# EAGLE design BD (EAGLE 6.4)
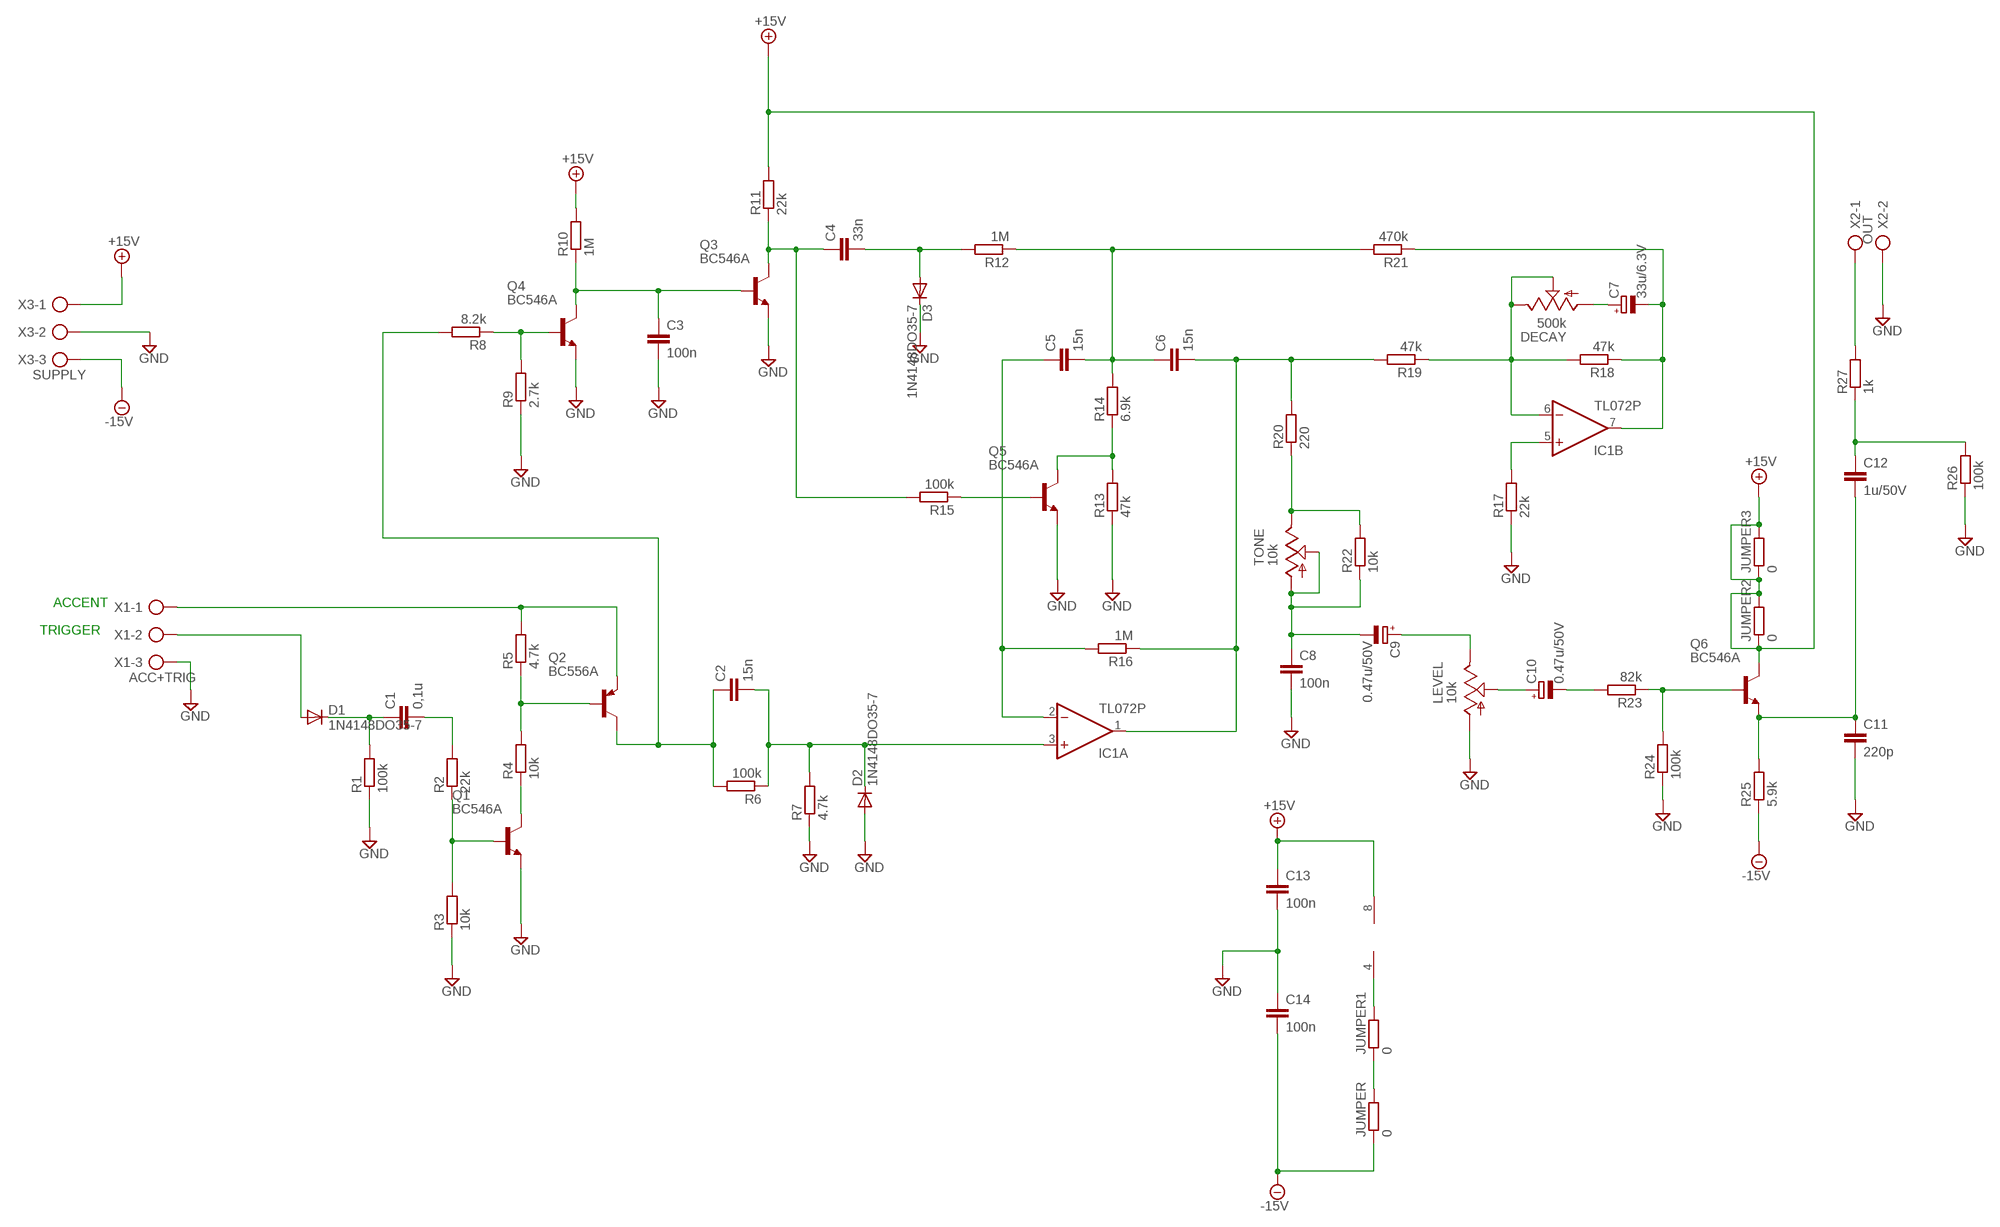
[diagram p0: schematic, sheet 1]

## Parts
C1  0,1u  C-EU075-042X103  [C075-042X103]
C2  15n  C-EU075-042X103  [C075-042X103]
C3  100n  C-EU075-042X103  [C075-042X103]
C4  33n  C-EU075-042X103  [C075-042X103]
C5  15n  C-EU075-042X103  [C075-042X103]
C6  15n  C-EU075-042X103  [C075-042X103]
C7  33u/6.3V  CPOL-EUE2-5  [E2-5]
C8  100n  C-EU075-042X103  [C075-042X103]
C9  0.47u/50V  CPOL-EUE2-5  [E2-5]
C10  0.47u/50V  CPOL-EUE2-5  [E2-5]
C11  220p  C-EU075-042X103  [C075-042X103]
C12  1u/50V  C-EU075-042X103  [C075-042X103]
C13  100n  C-EU075-042X103  [C075-042X103]
C14  100n  C-EU075-042X103  [C075-042X103]
D1  1N4148DO35-7  [DO35-7]
D2  1N4148DO35-7  [DO35-7]
D3  1N4148DO35-7  [DO35-7]
DECAY  500k  TRIM_US-CA9H  [CA9H]
IC1  TL072P  [DIL08]
JUMPER  0  R-EU_0207/10  [0207/10]
JUMPER1  0  R-EU_0207/10  [0207/10]
JUMPER2  0  R-EU_0207/10  [0207/10]
JUMPER3  0  R-EU_0207/10  [0207/10]
LEVEL  10k  TRIM_US-CA9H  [CA9H]
Q1  BC546A  [TO92-EBC]
Q2  BC556A  [TO92-EBC]
Q3  BC546A  [TO92-EBC]
Q4  BC546A  [TO92-EBC]
Q5  BC546A  [TO92-EBC]
Q6  BC546A  [TO92-EBC]
R1  100k  R-EU_0207/10  [0207/10]
R2  22k  R-EU_0207/10  [0207/10]
R3  10k  R-EU_0207/10  [0207/10]
R4  10k  R-EU_0207/10  [0207/10]
R5  4.7k  R-EU_0207/10  [0207/10]
R6  100k  R-EU_0207/10  [0207/10]
R7  4.7k  R-EU_0207/10  [0207/10]
R8  8.2k  R-EU_0207/10  [0207/10]
R9  2.7k  R-EU_0207/10  [0207/10]
R10  1M  R-EU_0207/10  [0207/10]
R11  22k  R-EU_0207/10  [0207/10]
R12  1M  R-EU_0207/10  [0207/10]
R13  47k  R-EU_0207/10  [0207/10]
R14  6.9k  R-EU_0207/10  [0207/10]
R15  100k  R-EU_0207/10  [0207/10]
R16  1M  R-EU_0207/10  [0207/10]
R17  22k  R-EU_0207/10  [0207/10]
R18  47k  R-EU_0207/10  [0207/10]
R19  47k  R-EU_0207/10  [0207/10]
R20  220  R-EU_0207/10  [0207/10]
R21  470k  R-EU_0207/10  [0207/10]
R22  10k  R-EU_0207/10  [0207/10]
R23  82k  R-EU_0207/10  [0207/10]
R24  100k  R-EU_0207/10  [0207/10]
R25  5.9k  R-EU_0207/10  [0207/10]
R26  100k  R-EU_0207/10  [0207/10]
R27  1k  R-EU_0207/10  [0207/10]
TONE  10k  TRIM_US-CA9H  [CA9H]
X1  ACC+TRIG  AK300/3  [AK300/3]
X2  OUT  AK300/2  [AK300/2]
X3  SUPPLY  AK300/3  [AK300/3]

## Nets
+15V: C13.1 IC1.8(P:V+) JUMPER2.1 JUMPER2.2 JUMPER3.1 JUMPER3.2 Q6.C R10.2 R11.2 X3.1
-15V: C14.2 JUMPER.1 R25.1 X3.3
GND: C3.2 C8.2 C11.2 C13.2 C14.1 D2.A D3.C LEVEL.A Q1.E Q3.E Q4.E Q5.E R1.1 R3.1 R7.1 R9.1 R13.1 R17.1 R24.1 R26.1 X1.3 X2.2 X3.2
N$1: Q2.E R5.2 X1.1
N$2: C1.1 D1.C R1.2
N$3: C1.2 R2.2
N$4: Q1.B R2.1 R3.2
N$5: DECAY.E DECAY.S IC1.6(B:-IN) R18.2 R19.1
N$6: Q1.C R4.1
N$7: Q2.B R4.2 R5.1
N$8: D1.A X1.2
N$9: C2.1 Q2.C R6.2 R8.2
N$10: C2.2 D2.C IC1.3(A:+IN) R6.1 R7.2
N$11: Q4.B R8.1 R9.2
N$12: C4.2 D3.A R12.2
N$13: C3.1 Q3.B Q4.C R10.1
N$14: C4.1 Q3.C R11.1 R15.2
N$15: Q5.B R15.1
N$16: Q5.C R13.2 R14.1
N$17: IC1.5(B:+IN) R17.2
N$18: JUMPER1.1 JUMPER.2
N$19: C5.1 IC1.2(A:-IN) R16.2
N$20: C6.2 IC1.1(A:OUT) R16.1 R19.2 R20.2
N$21: C7.- IC1.7(B:OUT) R18.1 R21.1
N$22: C7.+ DECAY.A
N$23: IC1.4(P:V-) JUMPER1.2
N$24: R20.1 R22.2 TONE.E
N$25: C8.1 C9.- R22.1 TONE.A TONE.S
N$26: C10.+ LEVEL.S
N$27: C10.- R23.2
N$28: Q6.B R23.1 R24.2
N$29: C9.+ LEVEL.E
N$30: C11.1 C12.2 Q6.E R25.2
N$31: C12.1 R26.2 R27.1
N$32: R27.2 X2.1
N$33: C5.2 C6.1 R12.1 R14.2 R21.2

## Notes on the sheet
- ACCENT
- TRIGGER

## Library data of the parts
C1-C6 C8 C11-C14 = rcl:C-EU: CAPACITOR, European symbol
C7 C9 C10 = rcl:CPOL-EU: POLARIZED CAPACITOR, European symbol
D1-D3 = diode:1N4148: DIODE high speed (Philips)
DECAY LEVEL TONE = pot:TRIM_US-: POTENTIOMETER
IC1 = linear:TL072: OP AMP
JUMPER JUMPER1-JUMPER3 R1-R27 = resistor:R-EU_: RESISTOR, European symbol
Q1 Q3-Q6 = transistor-npn:BC546*: NPN Transistor
Q2 = transistor-pnp:BC556*: PNP Transistror
X1 X3 = con-ptr500:AK300/3: CONNECTOR; OC_FARNELL: unknown; OC_NEWARK: unknown
X2 = con-ptr500:AK300/2: CONNECTOR; OC_FARNELL: unknown; OC_NEWARK: unknown

## Board
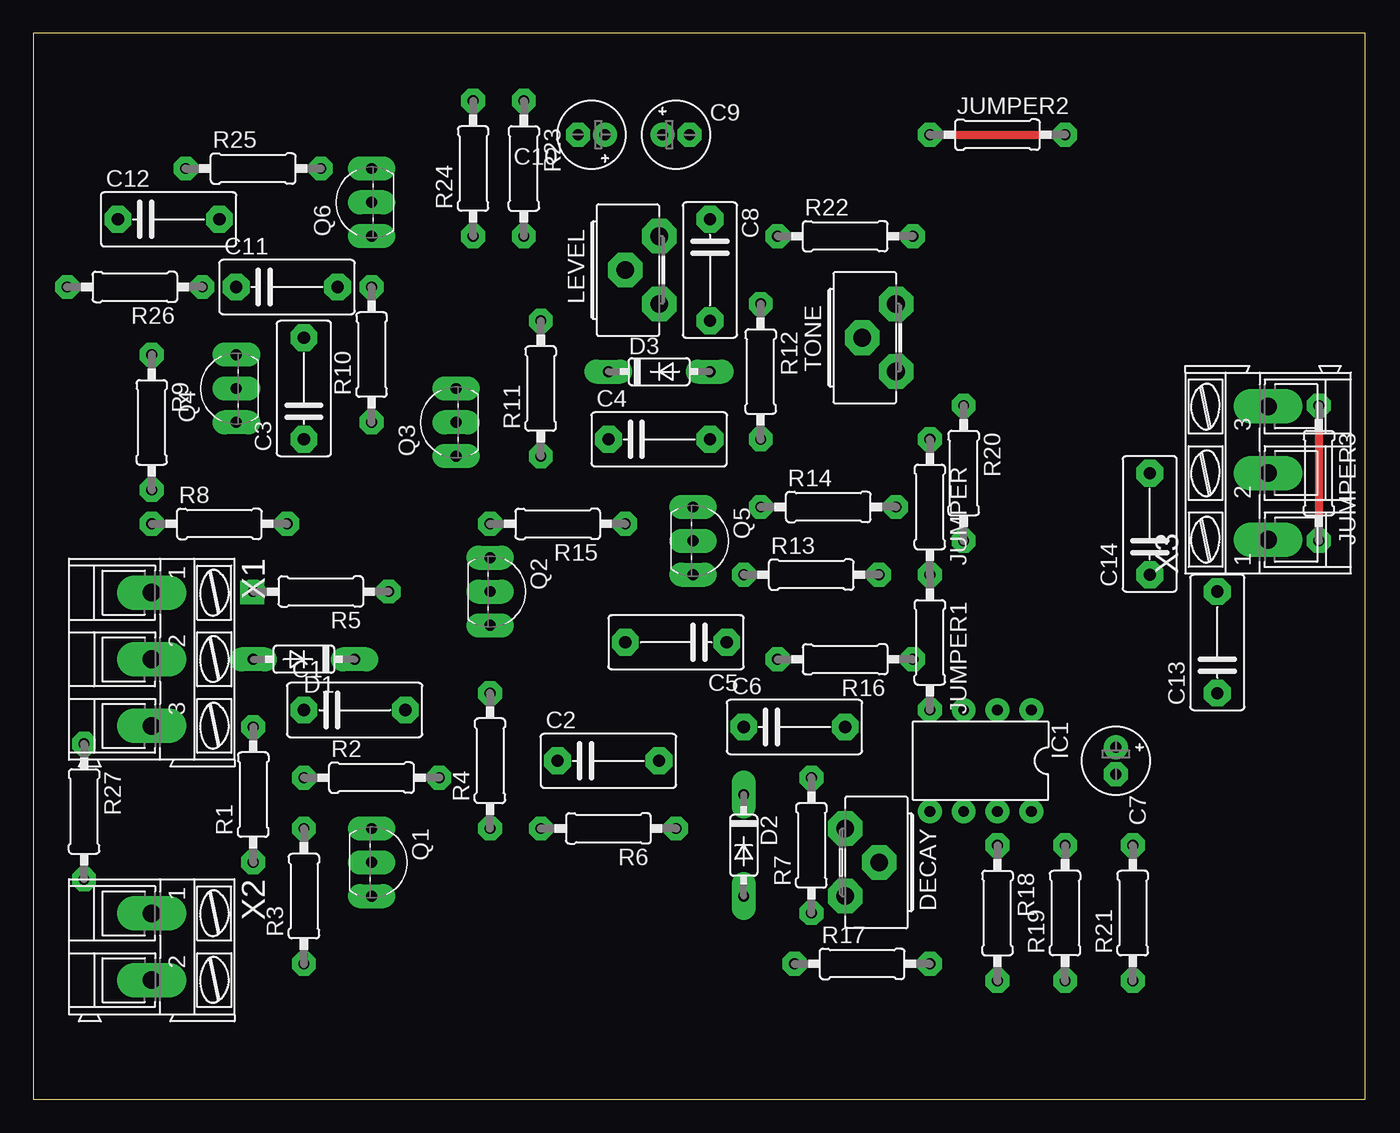
[diagram p1: board, top side]
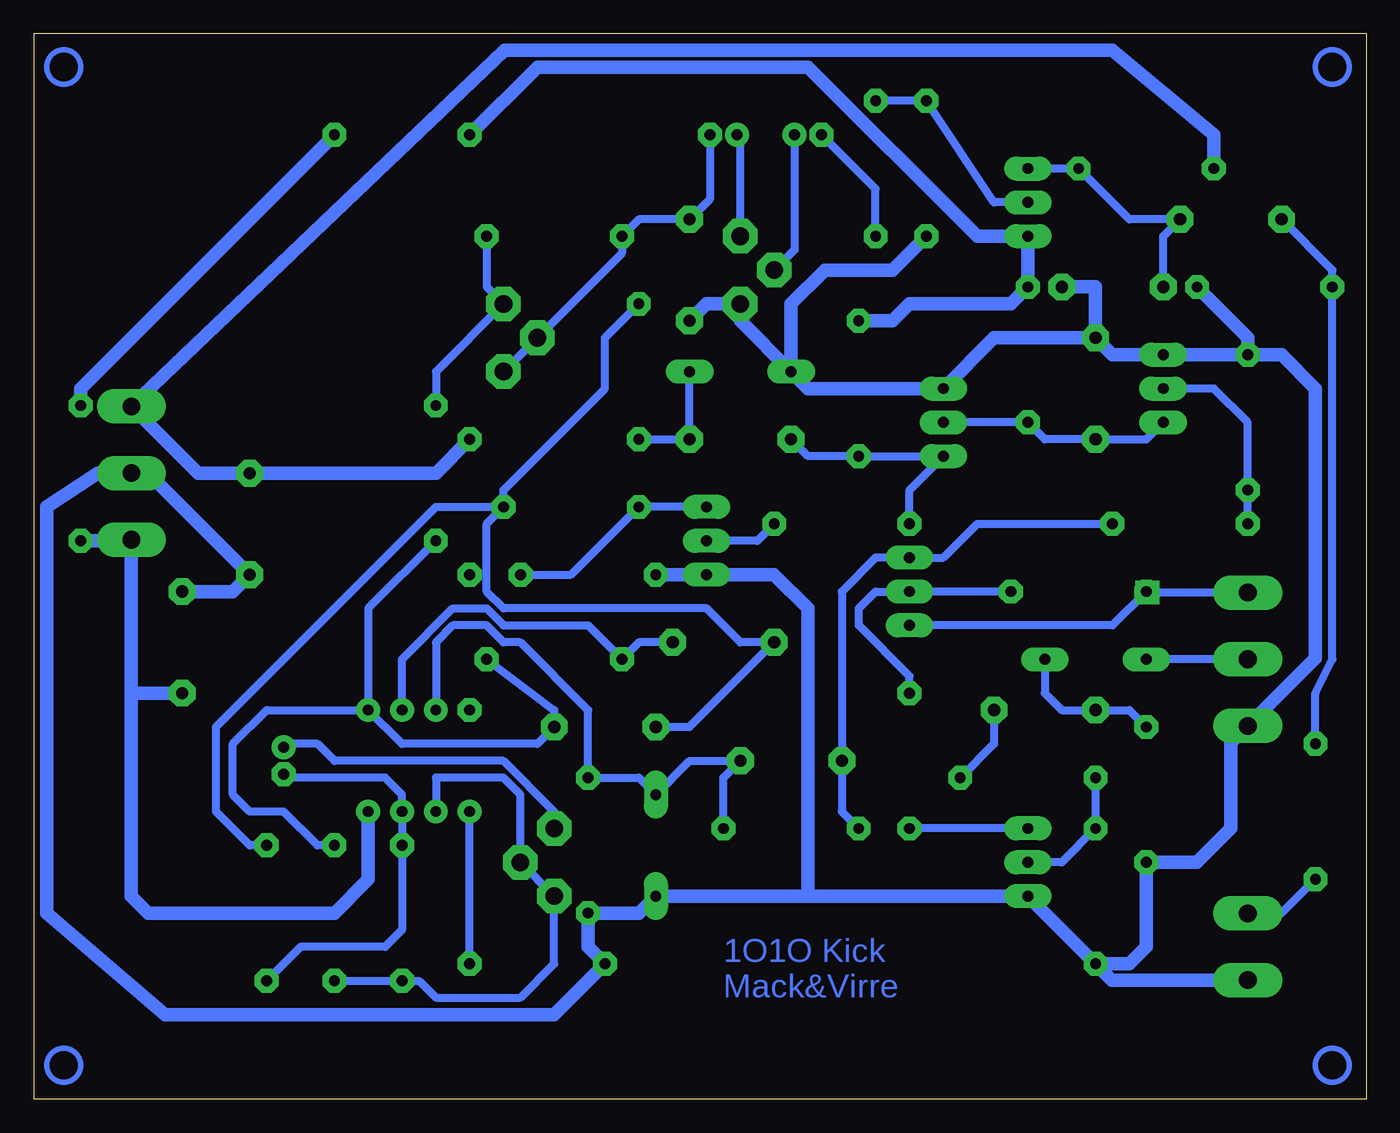
[diagram p2: board, bottom side, seen from below]

Size 100 x 80 mm. Coordinates in mm from the lower left corner, seen from the top.
Outline: 0,0 100,0 100,80 0,80 0,0
Copper layers (1*16): Top 0.035mm / dielectric 1.5mm / Bottom 0.035mm
Design rules "default *": minimum track width 10mil, minimum drill 24mil, track to track 8mil, track to pad 8mil, pad to pad 8mil, via to via 8mil, smd to smd 8mil, copper to edge 40mil, drill to drill 8mil, minimum pad ring 10mil, minimum via ring 8mil, stop-mask expansion 4mil, vias tented up to drill 0mil, thermal gap 30mil

### Footprints (pad centres in the part's own frame; a part is rotated, then mirrored left to right if it is on the bottom)
C075-042X103 = drill 0.914 octagon: 1 -3.81,0; 2 3.81,0
E2-5 = drill 0.813 pad 1.27: + -1.016,0 | drill 0.813 pad 1.27 octagon: - 1.016,0
DO35-7 = drill 0.813 long: A 3.81,0; C -3.81,0
CA9H = drill 1.321 octagon: A -2.54,0; E 2.54,0; S 0,2.54
DIL08 = drill 0.813 pad 1.27: 1 -3.81,-3.81; 2 -1.27,-3.81; 3 1.27,-3.81; 4 3.81,-3.81; 5 3.81,3.81; 6 1.27,3.81; 7 -1.27,3.81; 8 -3.81,3.81
0207/10 = drill 0.813 octagon: 1 -5.08,0; 2 5.08,0
TO92-EBC = drill 0.813 long: B 0,-1.27; C -2.54,-1.27; E 2.54,-1.27
AK300/3 = drill 1.321 long: 1 -5.004,0; 2 0,0; 3 5.004,0
AK300/2 = drill 1.321 long: 1 -2.515,0; 2 2.489,0

### Placement (x,y rotation side)
C1  24.13,29.21 0 top
C2  43.18,25.4 0 top
C3  20.32,53.34 90 top
C4  46.99,49.53 0 top
C5  48.26,34.29 180 top
C6  57.15,27.94 0 top
C7  81.28,25.4 270 top
C8  50.8,62.23 270 top
C9  48.26,72.39 0 top
C10  41.91,72.39 180 top
C11  19.05,60.96 0 top
C12  10.16,66.04 0 top
C13  88.9,34.29 90 top
C14  83.82,43.18 90 top
D1  20.32,33.02 180 top
D2  53.34,19.05 270 top
D3  46.99,54.61 0 top
DECAY  60.96,17.78 270 top
IC1  71.12,25.4 180 top
JUMPER  67.31,44.45 270 top
JUMPER1  67.31,34.29 270 top
JUMPER2  72.39,72.39 0 top
JUMPER3  96.52,46.99 270 top
LEVEL  46.99,62.23 90 top
Q1  26.67,17.78 270 top
Q2  35.56,38.1 270 top
Q3  30.48,50.8 90 top
Q4  13.97,53.34 90 top
Q5  50.8,41.91 270 top
Q6  24.13,67.31 90 top
R1  16.51,22.86 90 top
R2  25.4,24.13 0 top
R3  20.32,15.24 90 top
R4  34.29,25.4 90 top
R5  21.59,38.1 180 top
R6  43.18,20.32 180 top
R7  58.42,19.05 90 top
R8  13.97,43.18 0 top
R9  8.89,50.8 270 top
R10  25.4,55.88 90 top
R11  38.1,53.34 90 top
R12  54.61,54.61 270 top
R13  58.42,39.37 0 top
R14  59.69,44.45 0 top
R15  39.37,43.18 180 top
R16  60.96,33.02 180 top
R17  62.23,10.16 0 top
R18  72.39,13.97 270 top
R19  77.47,13.97 90 top
R20  69.85,46.99 270 top
R21  82.55,13.97 90 top
R22  60.96,64.77 0 top
R23  36.83,69.85 270 top
R24  33.02,69.85 90 top
R25  16.51,69.85 0 top
R26  7.62,60.96 180 top
R27  3.81,21.59 270 top
TONE  64.77,57.15 90 top
X1  8.89,33.02 270 top
X2  8.89,11.43 270 top
X3  92.71,46.99 90 top

### Tracks (layer width: path | path; a pad name or v marks a point on that pad's centre or on a via)
+15V
  Top 0.61: JUMPER2.1 JUMPER2.2 | JUMPER3.1 JUMPER3.2
  Bottom 0.61: 92.79,41.91 X3.1
  Bottom 1.016: IC1.8 74.93,16.51 77.47,13.97 91.44,13.97 92.71,15.24 92.71,30.48 | 92.71,30.48 X3.1 | C13.1 92.71,30.48 | JUMPER3.2 92.79,41.91 | JUMPER2.1 62.23,77.47 41.91,77.47 29.21,64.77 Q6.C R10.2 26.67,59.69 34.29,59.69 35.56,58.42 R11.2 | JUMPER2.2 96.52,53.34 JUMPER3.1
-15V
  Bottom 1.016: JUMPER.1 69.85,46.99 C14.2 87.71,46.99 X3.3 64.69,78.74 19.05,78.74 11.43,72.39 R25.1
GND
  Bottom 1.016: R3.1 Q1.E 41.91,15.24 | R3.1 17.78,10.16 16.51,11.43 R1.1 12.7,17.78 10.16,20.32 10.16,26.75 X1.3 3.81,33.1 3.81,53.34 6.35,55.88 R9.1 | 41.91,15.24 D2.A 54.61,13.97 R7.1 58.42,11.43 R17.1 60.96,6.35 90.17,6.35 99.06,13.97 99.06,44.45 95.25,46.99 X3.2 91.44,46.99 C14.1 85.09,38.1 C13.2 | R9.1 Q4.E 19.05,55.88 C3.2 | C3.2 27.94,57.15 Q3.E 41.91,53.34 D3.C | 41.91,15.24 41.91,36.83 44.45,39.37 Q5.E R13.1 | C3.2 20.32,60.96 C11.2 | D3.C 43.18,59.69 40.64,62.23 35.56,62.23 R24.1 | D3.C 46.99,58.42 LEVEL.A 49.53,59.69 C8.2 | X2.2 19.1,8.94 R3.1 | R9.1 8.89,57.15 R26.1
N$1  (via drill 0.6 pad 1.78)
  Top 0.61: v16.43,38.02 R5.2
  Bottom 0.61: X1.1 v16.43,38.02 | R5.2 19.05,35.56 Q2.E
N$2
  Bottom 0.61: D1.C 24.13,30.48 22.86,29.21 C1.1 17.78,29.21 R1.2
N$3
  Bottom 0.61: C1.2 27.94,26.67 R2.2
N$4
  Bottom 0.61: R2.1 R3.2 22.86,17.78 Q1.B
N$5
  Bottom 0.61: R19.1 R18.2 71.12,8.89 69.85,7.62 63.5,7.62 60.96,10.16 DECAY.E DECAY.S 63.5,22.86 64.77,24.13 69.85,24.13 IC1.6
N$6
  Bottom 0.61: Q1.C R4.1
N$7
  Bottom 0.61: R4.2 34.29,31.75 38.1,35.56 38.1,36.83 36.83,38.1 Q2.B R5.1
N$8
  Bottom 0.61: X1.2 D1.A
N$9
  Bottom 0.61: R6.2 39.37,21.59 C2.1 39.37,38.1 36.83,40.64 Q2.C 31.75,40.64 29.21,43.18 R8.2
N$10
  Bottom 0.61: R6.1 48.26,24.13 C2.2 50.8,25.4 D2.C 54.61,24.13 R7.2 58.42,29.21 63.5,34.29 64.77,34.29 66.04,35.56 68.58,35.56 69.85,34.29 IC1.3
N$11
  Bottom 0.61: R8.1 R9.2 8.89,50.8 11.43,53.34 Q4.B
N$12
  Bottom 0.61: R12.2 C4.2 D3.A
N$13
  Bottom 0.61: Q4.C 16.51,49.53 C3.1 24.13,49.53 R10.1 Q3.B
N$14
  Bottom 0.61: R15.2 34.29,45.72 Q3.C R11.1 41.91,48.26 C4.1
N$15
  Bottom 0.61: R15.1 45.72,41.91 Q5.B
N$16
  Bottom 0.61: Q5.C R14.1 59.69,39.37 R13.2
N$17
  Bottom 0.61: R17.2 IC1.5
N$19
  Bottom 0.61: C5.1 54.61,34.29 R16.2 58.42,35.56 64.77,35.56 66.04,36.83 68.58,36.83 72.39,33.02 IC1.2
N$20
  Bottom 0.61: R16.1 60.96,29.21 C6.2 62.23,26.67 72.39,26.67 IC1.1 | R19.2 78.74,19.05 81.28,21.59 83.82,21.59 85.09,22.86 85.09,26.67 82.55,29.21 IC1.1 | R20.2 74.93,36.83 IC1.1
N$21
  Bottom 0.61: C7.- 81.03,24.13 73.66,24.13 72.39,22.86 IC1.7 R18.1 72.39,12.7 73.66,11.43 80.01,11.43 R21.1
N$22
  Bottom 0.61: DECAY.A 60.96,21.59 64.77,25.4 77.47,25.4 78.74,26.67 81.03,26.67 C7.+
N$24
  Bottom 0.61: R22.2 66.04,60.96 TONE.E 69.85,54.61 R20.1
N$25
  Bottom 0.61: C9.- 49.28,67.56 C8.1 54.61,66.04 R22.1 55.88,63.5 TONE.S TONE.A
N$26
  Bottom 0.61: C10.+ 42.93,63.75 LEVEL.S
N$27
  Bottom 0.61: R23.2 36.83,68.33 C10.-
N$28
  Bottom 0.61: Q6.B 27.94,67.31 R24.2 R23.1
N$29
  Bottom 0.61: LEVEL.E 46.99,72.14 C9.+
N$30
  Bottom 0.61: Q6.E R25.2 17.78,66.04 C12.2 15.24,64.77 C11.1
N$31
  Bottom 0.61: R27.1 3.81,30.48 2.54,33.02 R26.2 2.54,62.23 C12.1
N$32
  Bottom 0.61: X2.1 6.38,13.95 R27.2
N$33
  Bottom 0.61: R21.2 83.82,19.05 86.36,21.59 86.36,27.94 69.85,44.45 R14.2 | R14.2 64.77,45.72 57.15,53.34 57.15,57.15 R12.1 | C6.1 50.8,27.94 C5.2 46.99,34.29 49.53,36.83 64.77,36.83 66.04,38.1 66.04,43.18 R14.2
(copper drawn outside any net)
  shapes: Bottom circle x4

### Text on the board
Bottom: 1O1O Kick / Mack&Virre